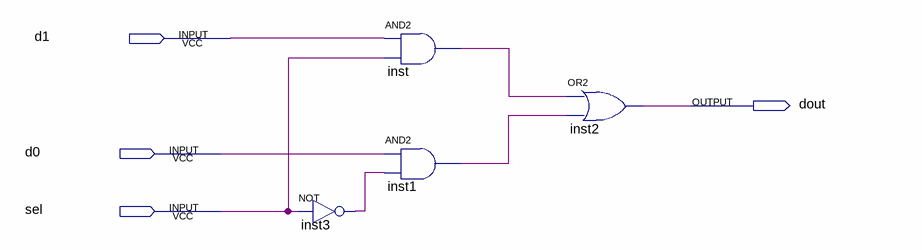
[diagram p0: schematic sheet]
// Quartus schematic mux2x1.bdf as structural Verilog: 4 symbols, 4 pins
module mux2x1 (
  input  d1,
  input  d0,
  input  sel,
  output dout
);

  wire inst1_out, inst3_out, inst_out;

  not inst3 (inst3_out, sel);
  and inst (inst_out, d1, sel);
  and inst1 (inst1_out, d0, inst3_out);
  or inst2 (dout, inst_out, inst1_out);
endmodule
